# EAGLE design four_channel_audio_mixer (EAGLE 9.6.2)

## Sheet 1 of 3
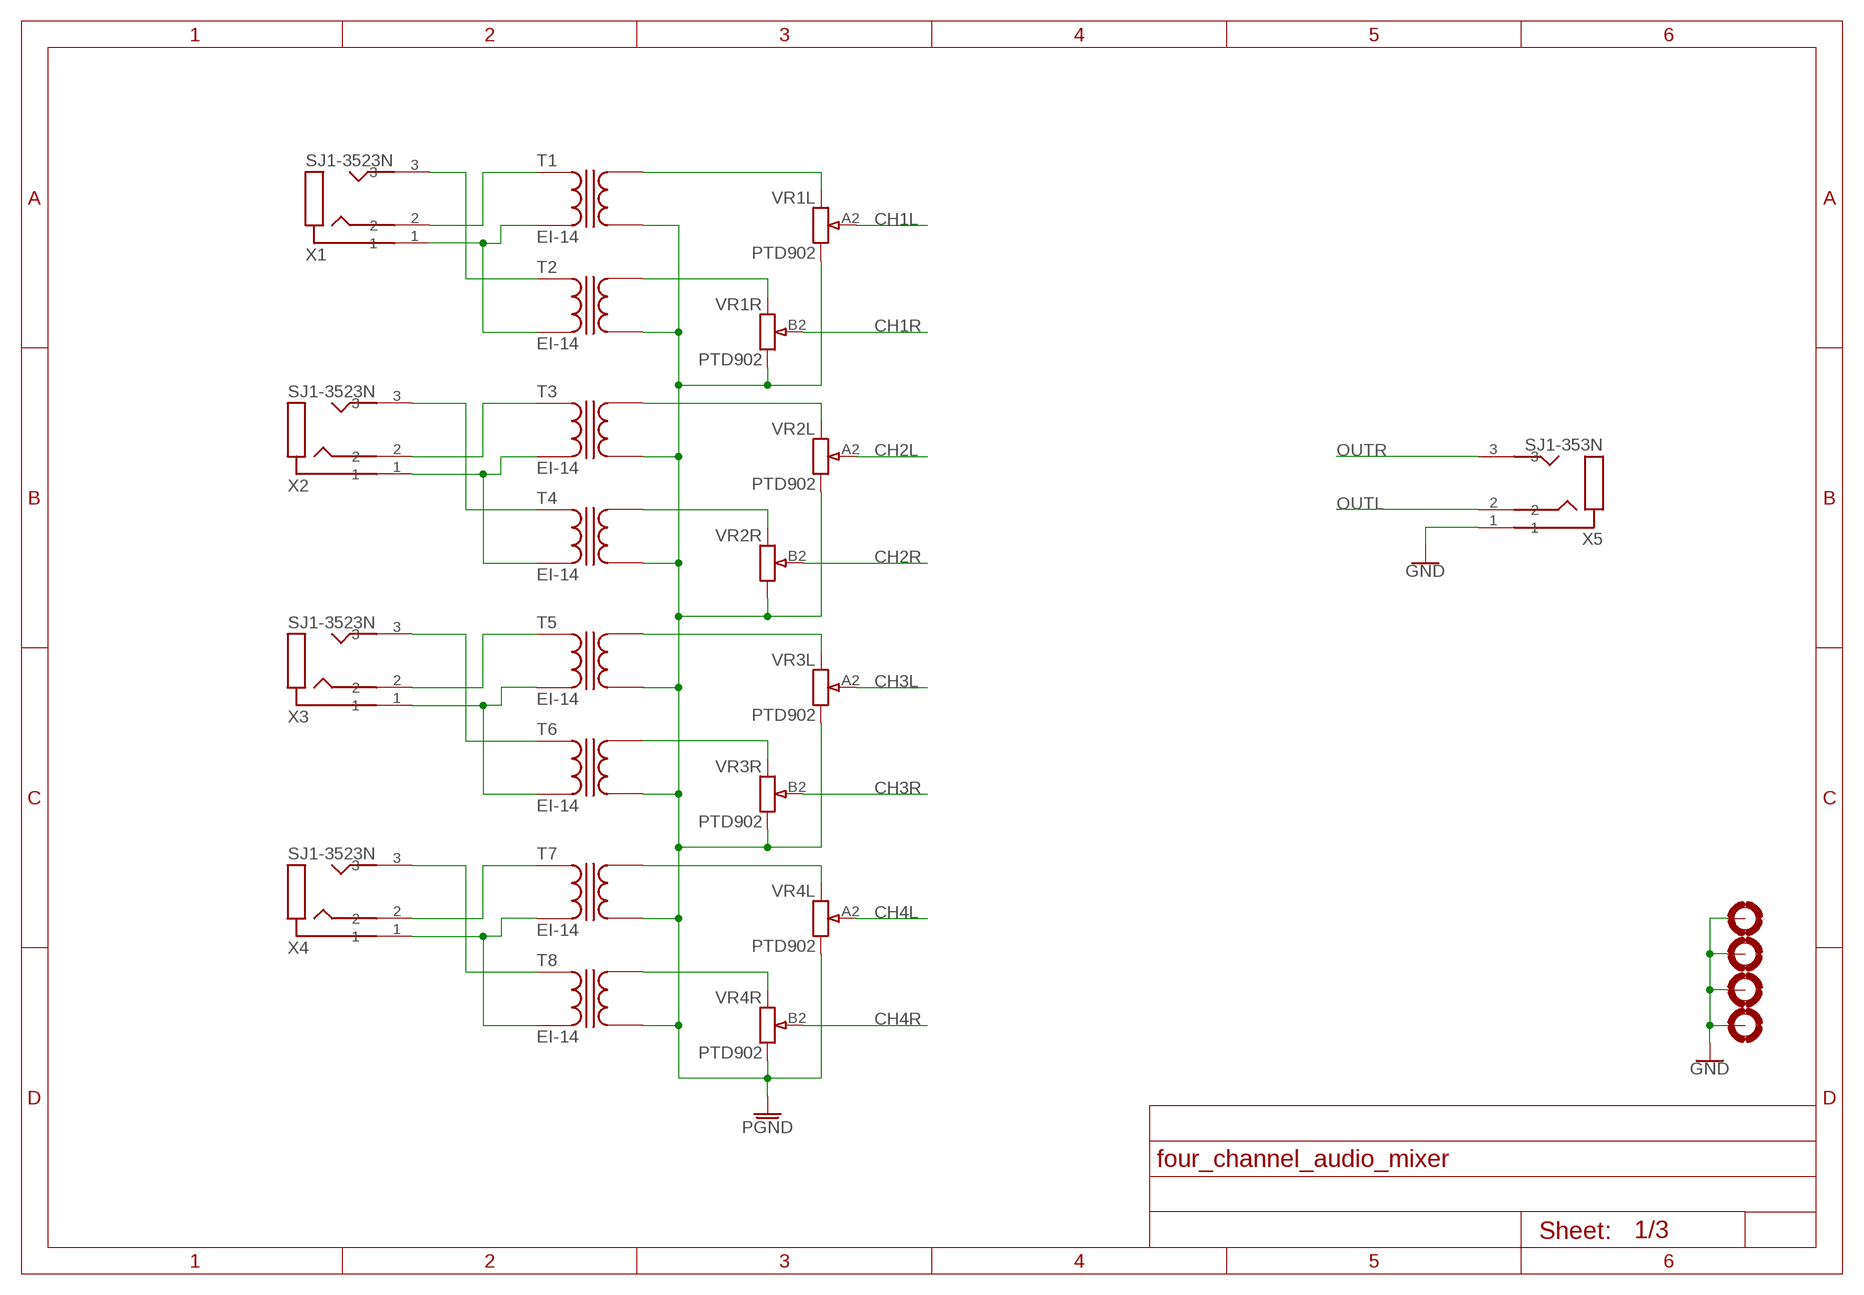
[diagram p0: schematic, sheet 1]

### Parts
H1  MOUNTHOLE-PAD3.2  [3.2-PAD]
H2  MOUNTHOLE-PAD3.2  [3.2-PAD]
H3  MOUNTHOLE-PAD3.2  [3.2-PAD]
H4  MOUNTHOLE-PAD3.2  [3.2-PAD]
T1  EI-14  TRANSFORMEREI14  [TRANSFORMER_EI14]
T2  EI-14  TRANSFORMEREI14  [TRANSFORMER_EI14]
T3  EI-14  TRANSFORMEREI14  [TRANSFORMER_EI14]
T4  EI-14  TRANSFORMEREI14  [TRANSFORMER_EI14]
T5  EI-14  TRANSFORMEREI14  [TRANSFORMER_EI14]
T6  EI-14  TRANSFORMEREI14  [TRANSFORMER_EI14]
T7  EI-14  TRANSFORMEREI14  [TRANSFORMER_EI14]
T8  EI-14  TRANSFORMEREI14  [TRANSFORMER_EI14]
VR1  PTD902  POT-PTD902  [POT-PTD902]
VR2  PTD902  POT-PTD902  [POT-PTD902]
VR3  PTD902  POT-PTD902  [POT-PTD902]
VR4  PTD902  POT-PTD902  [POT-PTD902]
X1  SJ1-3523N  AUDIO-3.5-SJ1-3523N  [AUDIO-3.5-SJ1-3523N]
X2  SJ1-3523N  AUDIO-3.5-SJ1-3523N  [AUDIO-3.5-SJ1-3523N]
X3  SJ1-3523N  AUDIO-3.5-SJ1-3523N  [AUDIO-3.5-SJ1-3523N]
X4  SJ1-3523N  AUDIO-3.5-SJ1-3523N  [AUDIO-3.5-SJ1-3523N]
X5  SJ1-353N  AUDIO-3.5-SJ1-3523N  [AUDIO-3.5-SJ1-3523N]

### Nets
CH1L: VR1.A2 ; also sheet 2
CH1R: VR1.B2 ; also sheet 2
CH2L: VR2.A2 ; also sheet 2
CH2R: VR2.B2 ; also sheet 2
CH3L: VR3.A2 ; also sheet 2
CH3R: VR3.B2 ; also sheet 2
CH4L: VR4.A2 ; also sheet 2
CH4R: VR4.B2 ; also sheet 2
GND: H1.B3,2(MOUNT) H2.B3,2(MOUNT) H3.B3,2(MOUNT) H4.B3,2(MOUNT) X5.1 ; also sheet 2,3
N$1: T1.A1 X1.2
N$2: T2.A1 X1.3
N$3: T3.A2 T4.A2 X2.1
N$4: T1.A2 T2.A2 X1.1
N$5: T1.B2 VR1.A3
N$7: T2.B2 VR1.B3
N$8: T3.A1 X2.2
N$9: T4.A1 X2.3
N$10: T5.A2 T6.A2 X3.1
N$11: T5.A1 X3.2
N$13: T6.A1 X3.3
N$14: T7.A2 T8.A2 X4.1
N$15: T7.A1 X4.2
N$16: T8.A1 X4.3
N$17: T3.B2 VR2.A3
N$18: T4.B2 VR2.B3
N$21: T5.B2 VR3.A3
N$22: T6.B2 VR3.B3
N$25: T7.B2 VR4.A3
N$26: T8.B2 VR4.B3
OUTL: X5.2 ; also sheet 2
OUTR: X5.3 ; also sheet 2
PGND: T1.B1 T2.B1 T3.B1 T4.B1 T5.B1 T6.B1 T7.B1 T8.B1 VR1.A1 VR1.B1 VR2.A1 VR2.B1 VR3.A1 VR3.B1 VR4.A1 VR4.B1 ; also sheet 2,3

## Sheet 2 of 3
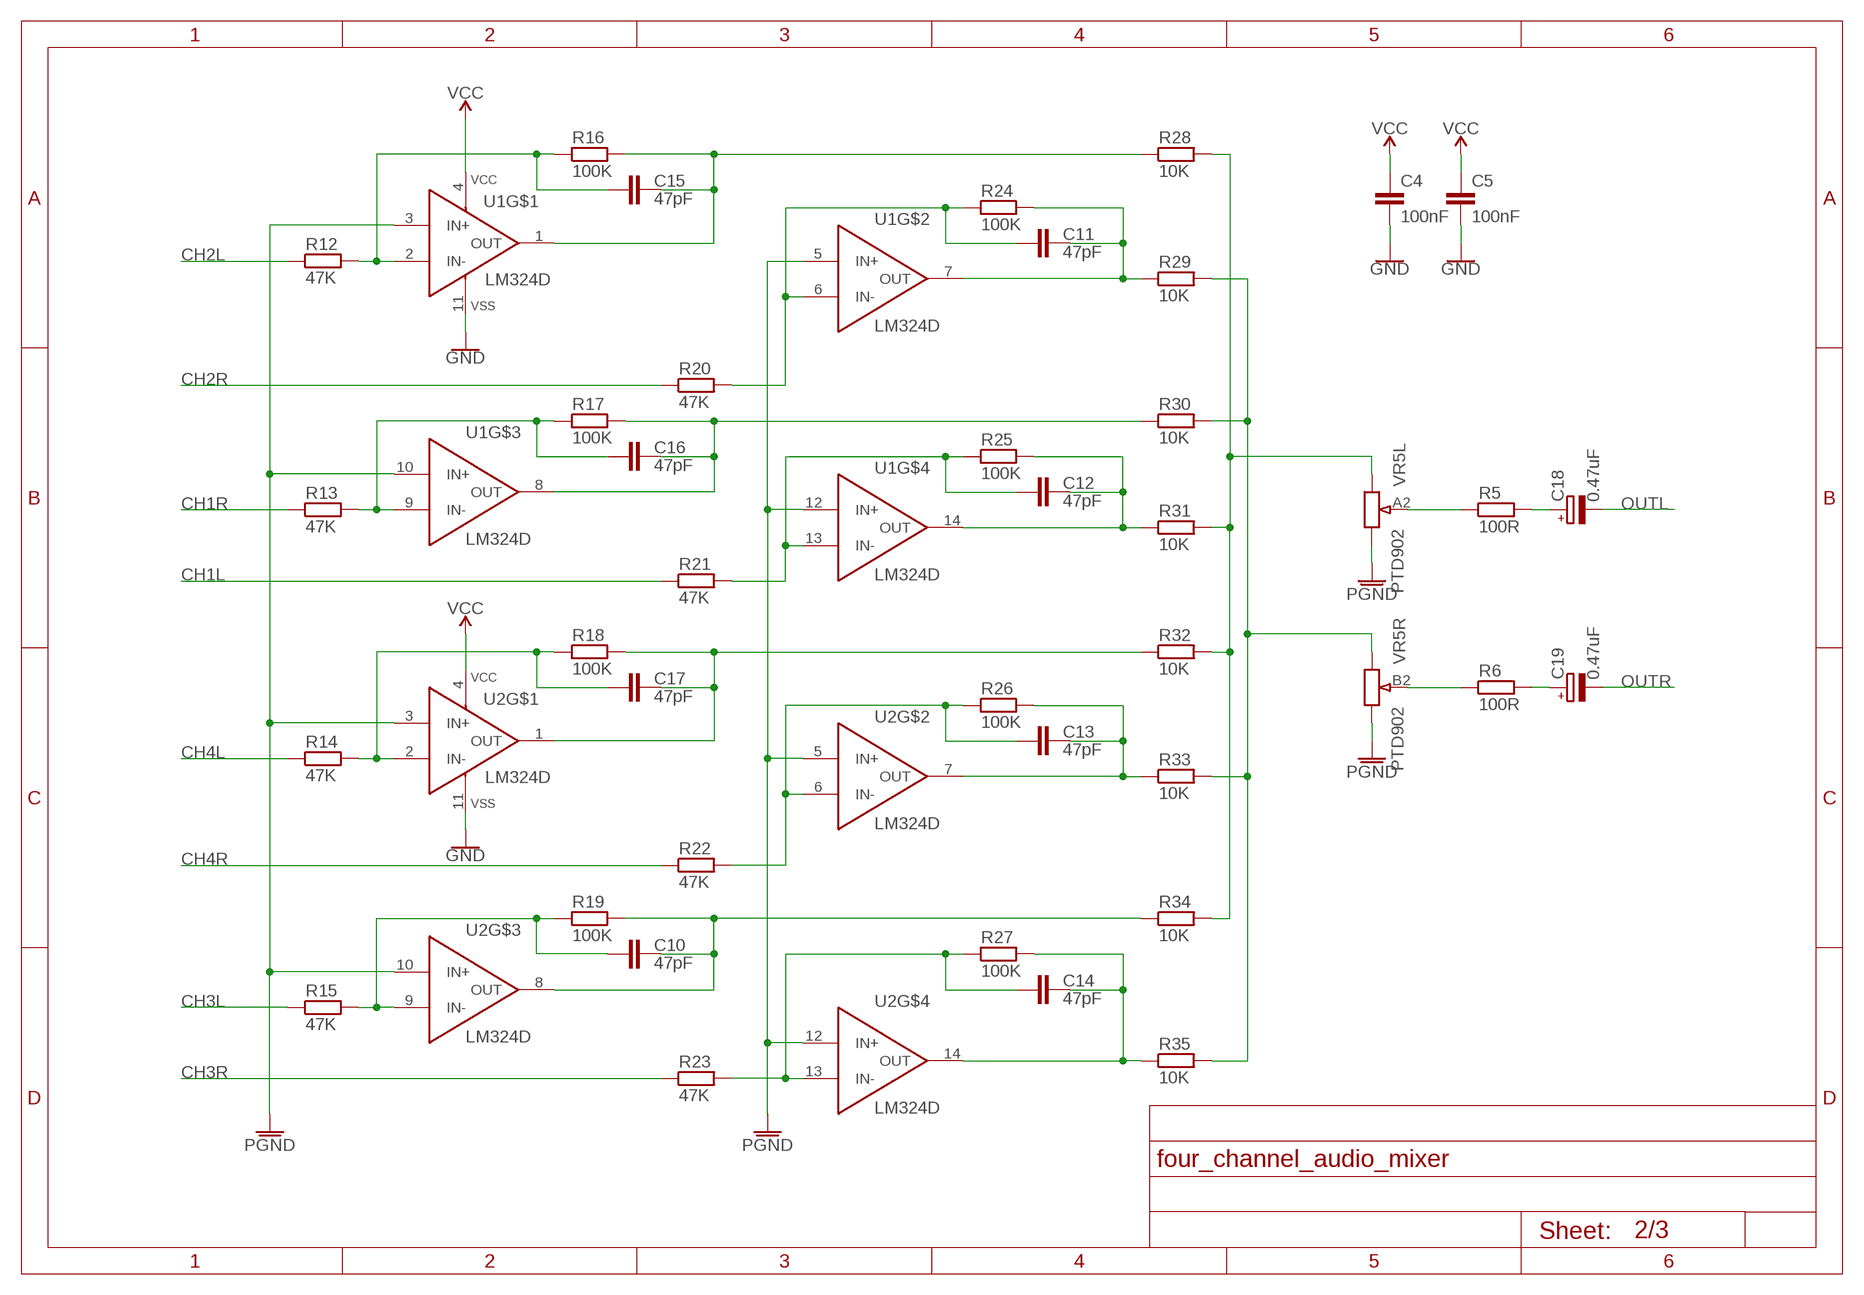
[diagram p1: schematic, sheet 2]

### Parts
C4  100nF  CAPC0603  [C0603]
C5  100nF  CAPC0603  [C0603]
C10  47pF  CAPC0603  [C0603]
C11  47pF  CAPC0603  [C0603]
C12  47pF  CAPC0603  [C0603]
C13  47pF  CAPC0603  [C0603]
C14  47pF  CAPC0603  [C0603]
C15  47pF  CAPC0603  [C0603]
C16  47pF  CAPC0603  [C0603]
C17  47pF  CAPC0603  [C0603]
C18  0.47uF  CAP-POL-ALUMWURTH-4.0X5.5  [WE-4.0X5.5]
C19  0.47uF  CAP-POL-ALUMWURTH-4.0X5.5  [WE-4.0X5.5]
R5  100R  RESISTOR0603  [R0603]
R6  100R  RESISTOR0603  [R0603]
R12  47K  RESISTOR0603  [R0603]
R13  47K  RESISTOR0603  [R0603]
R14  47K  RESISTOR0603  [R0603]
R15  47K  RESISTOR0603  [R0603]
R16  100K  RESISTOR0603  [R0603]
R17  100K  RESISTOR0603  [R0603]
R18  100K  RESISTOR0603  [R0603]
R19  100K  RESISTOR0603  [R0603]
R20  47K  RESISTOR0603  [R0603]
R21  47K  RESISTOR0603  [R0603]
R22  47K  RESISTOR0603  [R0603]
R23  47K  RESISTOR0603  [R0603]
R24  100K  RESISTOR0603  [R0603]
R25  100K  RESISTOR0603  [R0603]
R26  100K  RESISTOR0603  [R0603]
R27  100K  RESISTOR0603  [R0603]
R28  10K  RESISTOR0603  [R0603]
R29  10K  RESISTOR0603  [R0603]
R30  10K  RESISTOR0603  [R0603]
R31  10K  RESISTOR0603  [R0603]
R32  10K  RESISTOR0603  [R0603]
R33  10K  RESISTOR0603  [R0603]
R34  10K  RESISTOR0603  [R0603]
R35  10K  RESISTOR0603  [R0603]
U1  LM324D  OPAMP-LM324D  [SOIC-14]
U2  LM324D  OPAMP-LM324D  [SOIC-14]
VR5  PTD902  POT-PTD902  [POT-PTD902]

### Nets
CH1L: R21.1 ; also sheet 1
CH1R: R13.1 ; also sheet 1
CH2L: R12.1 ; also sheet 1
CH2R: R20.1 ; also sheet 1
CH3L: R15.1 ; also sheet 1
CH3R: R23.1 ; also sheet 1
CH4L: R14.1 ; also sheet 1
CH4R: R22.1 ; also sheet 1
F1L: C12.2 R21.2 R25.1 U1.13(IN-)
F1R: C16.2 R13.2 R17.1 U1.9(IN-)
F2L: C11.2 R20.2 R24.1 U1.6(IN-)
F2R: C15.2 R12.2 R16.1 U1.2(IN-)
GND: C4.2 C5.2 U1.11(VSS) U2.11(VSS) ; also sheet 1,3
MIXL: R28.2 R31.2 R32.2 R34.2 VR5.A3
MIXR: R29.2 R30.2 R33.2 R35.2 VR5.B3
N$6: C18.+ R5.2
N$20: R5.1 VR5.A2
N$23: C19.+ R6.2
N$32: R6.1 VR5.B2
N$56: C15.1 R16.2 R28.1 U1.1(OUT)
N$57: C11.1 R24.2 R29.1 U1.7(OUT)
N$59: C16.1 R17.2 R30.1 U1.8(OUT)
N$61: C12.1 R25.2 R31.1 U1.14(OUT)
N$62: C17.1 R18.2 R32.1 U2.1(OUT)
N$63: C17.2 R14.2 R18.1 U2.2(IN-)
N$65: C13.1 R26.2 R33.1 U2.7(OUT)
N$66: C10.1 R19.2 R34.1 U2.8(OUT)
N$67: C10.2 R15.2 R19.1 U2.9(IN-)
N$69: C14.1 R27.2 R35.1 U2.14(OUT)
N$85: C13.2 R22.2 R26.1 U2.6(IN-)
N$86: C14.2 R23.2 R27.1 U2.13(IN-)
OUTL: C18.- ; also sheet 1
OUTR: C19.- ; also sheet 1
PGND: U1.3(IN+) U1.5(IN+) U1.10(IN+) U1.12(IN+) U2.3(IN+) U2.5(IN+) U2.10(IN+) U2.12(IN+) VR5.A1 VR5.B1 ; also sheet 1,3
VCC: C4.1 C5.1 U1.4(VCC) U2.4(VCC) ; also sheet 3

## Sheet 3 of 3
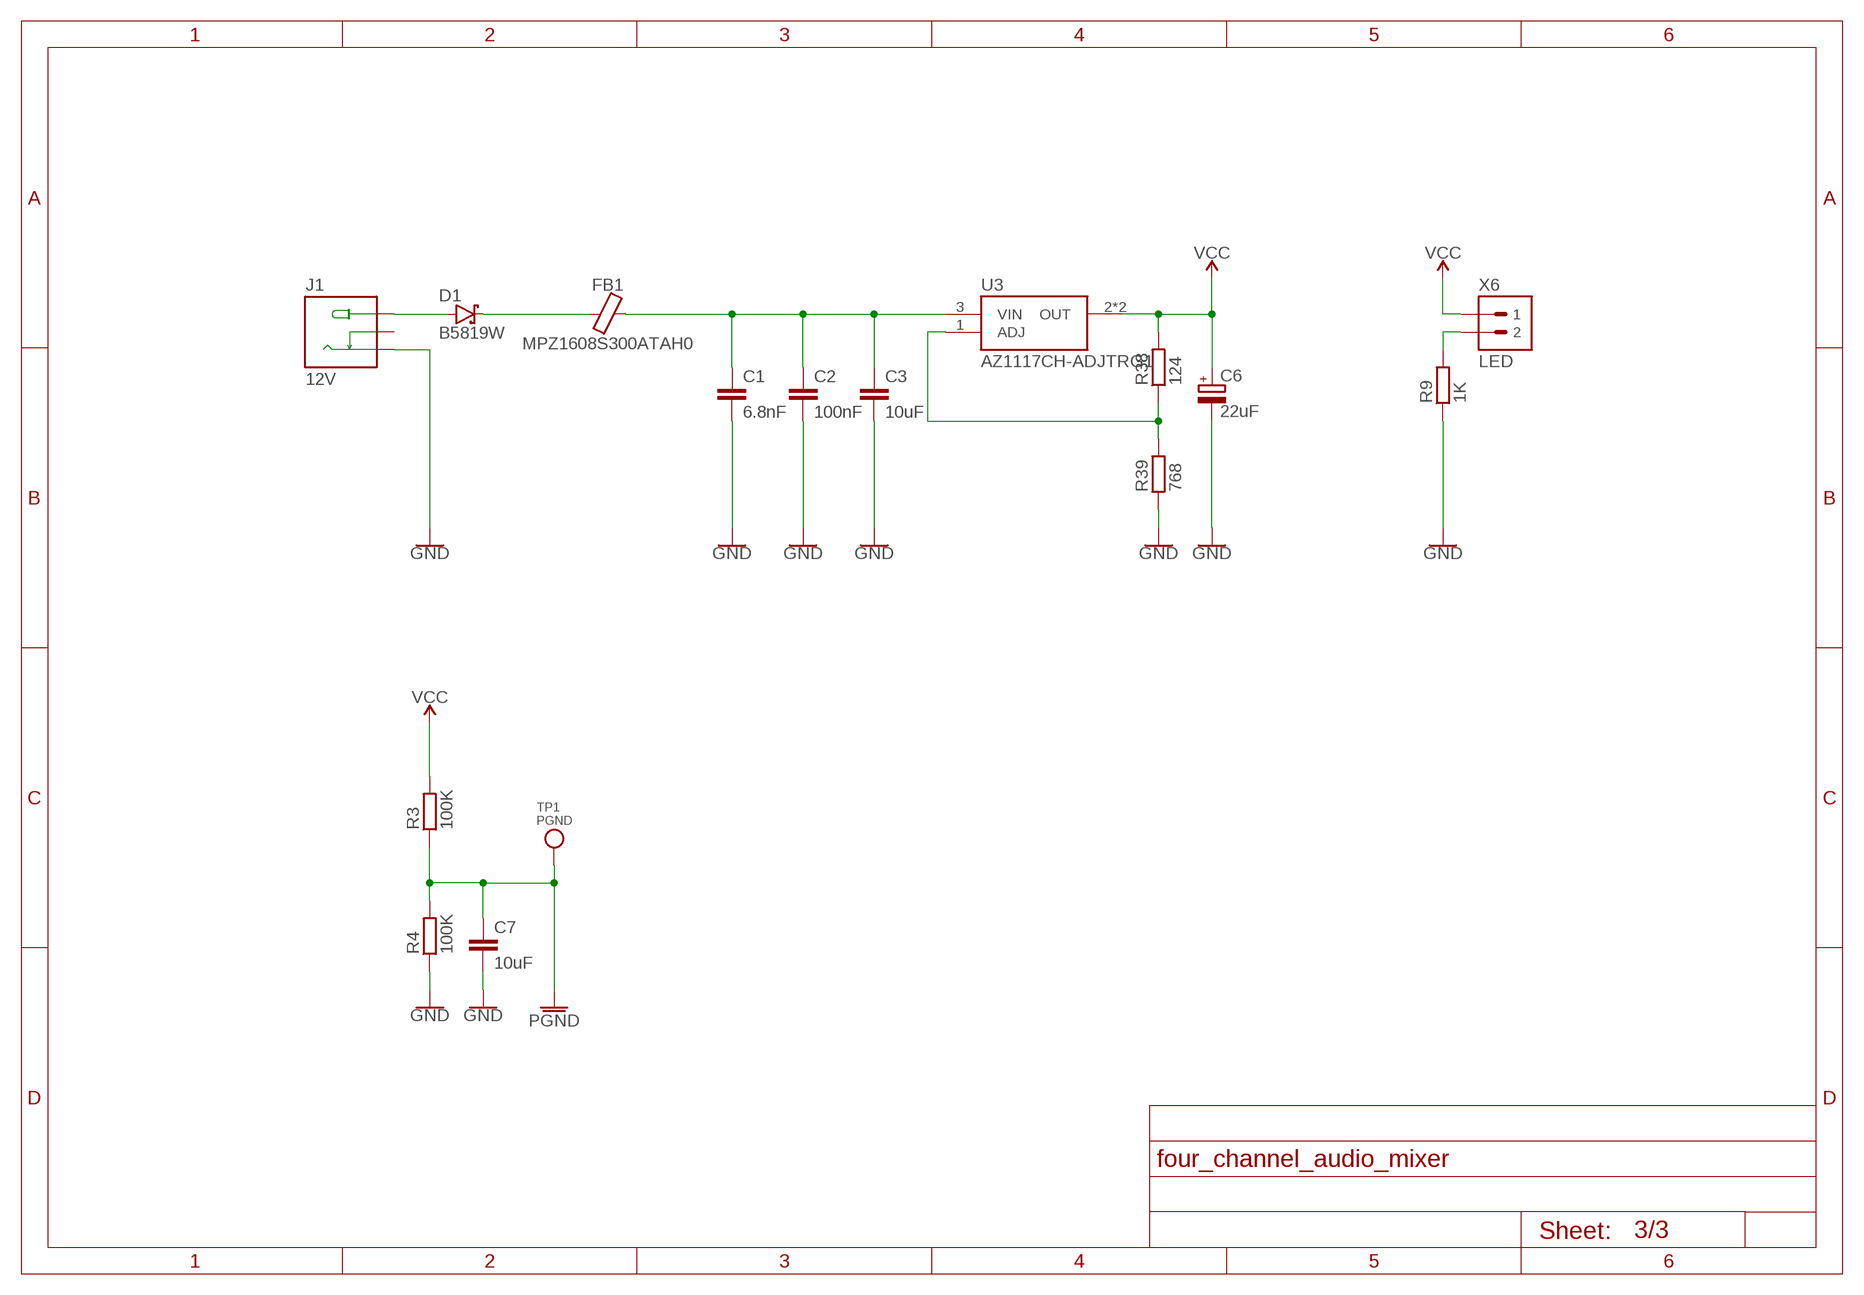
[diagram p2: schematic, sheet 3]

### Parts
C1  6.8nF  CAPC0603  [C0603]
C2  100nF  CAPC0603  [C0603]
C3  10uF  CAPC0603  [C0603]
C6  22uF  CAP-TANT-HUNANB-3528  [CASE-B-3528]
C7  10uF  CAPC0603  [C0603]
D1  B5819W  DIODE-SCHOTTKYSOD-123  [SOD-123]
FB1  MPZ1608S300ATAH0  BEADMPZ1608  [MPZ1608]
J1  12V  CONN-POWER-JACK-2.1MM(DC-005)5DJ20DC02  [5DJ20DC02-03T0BLB-01-14.5X10.7.0X9.0MM]
R3  100K  RESISTOR0603  [R0603]
R4  100K  RESISTOR0603  [R0603]
R9  1K  RESISTOR0603  [R0603]
R38  124  RESISTOR0603  [R0603]
R39  768  RESISTOR0603  [R0603]
TP1  PGND  TESTPOINT0.1"  [1X01_ROUND]
U3  AZ1117CH-ADJTRG1  DIODES-AZ1117CH-ADJTRG1  [SOT-223]
X6  LED  HEADER-1X02-2.54POL  [1X02P-2.54]

### Nets
GND: C1.2 C2.2 C3.2 C6.- C7.2 J1.-1(-) R4.1 R9.1 R39.1 ; also sheet 1,2
N$24: R9.2 X6.2
N$27: D1.A J1.+
N$28: R38.1 R39.2 U3.1(ADJ)
N$29: C1.1 C2.1 C3.1 FB1.2 U3.3(VIN)
N$30: D1.C FB1.1
PGND: C7.1 R3.1 R4.2 TP1.1 ; also sheet 1,2
VCC: C6.+ R3.2 R38.2 U3.2(OUT) U3.4(OUT) X6.1 ; also sheet 2
Unconnected: J1.-2(CDN)

## Library data of the parts
C1-C5 C7 C10-C17 = M2M-Passives:CAP
C6 = M2M-Passives:CAP-TANT-HUNAN
C18 C19 = M2M-Passives:CAP-POL-ALUM
D1 = M2M-DiscreteSemi:DIODE-SCHOTTKY: 304020028
FB1 = M2M-Passives:BEAD
H1-H4 = M2M-Holes:MOUNTHOLE-PAD
J1 = M2M-Connectors:CONN-POWER-JACK-2.1MM(DC-005): 320120003
R3-R6 R9 R12-R35 R38 R39 = M2M-Passives:RESISTOR
T1-T8 = M2M-Passives:TRANSFORMER
TP1 = M2M-TestPoints:TESTPOINT: Test Point Various test points for characterisation and PCB testing TESTPOINT_SMT - Compact Surface Mount Test Point [Digikey: 5016KTR-ND]; BOM: EXCLUDE
U1 U2 = M2M-IC:OPAMP-LM324D
U3 = M2M-IC:DIODES-AZ1117CH-ADJTRG1
VR1-VR5 = M2M-Passives:POT-PTD902
X1-X5 = M2M-Connectors:AUDIO-3.5-SJ1-3523N
X6 = M2M-Connectors:HEADER-1X02-2.54

## Board
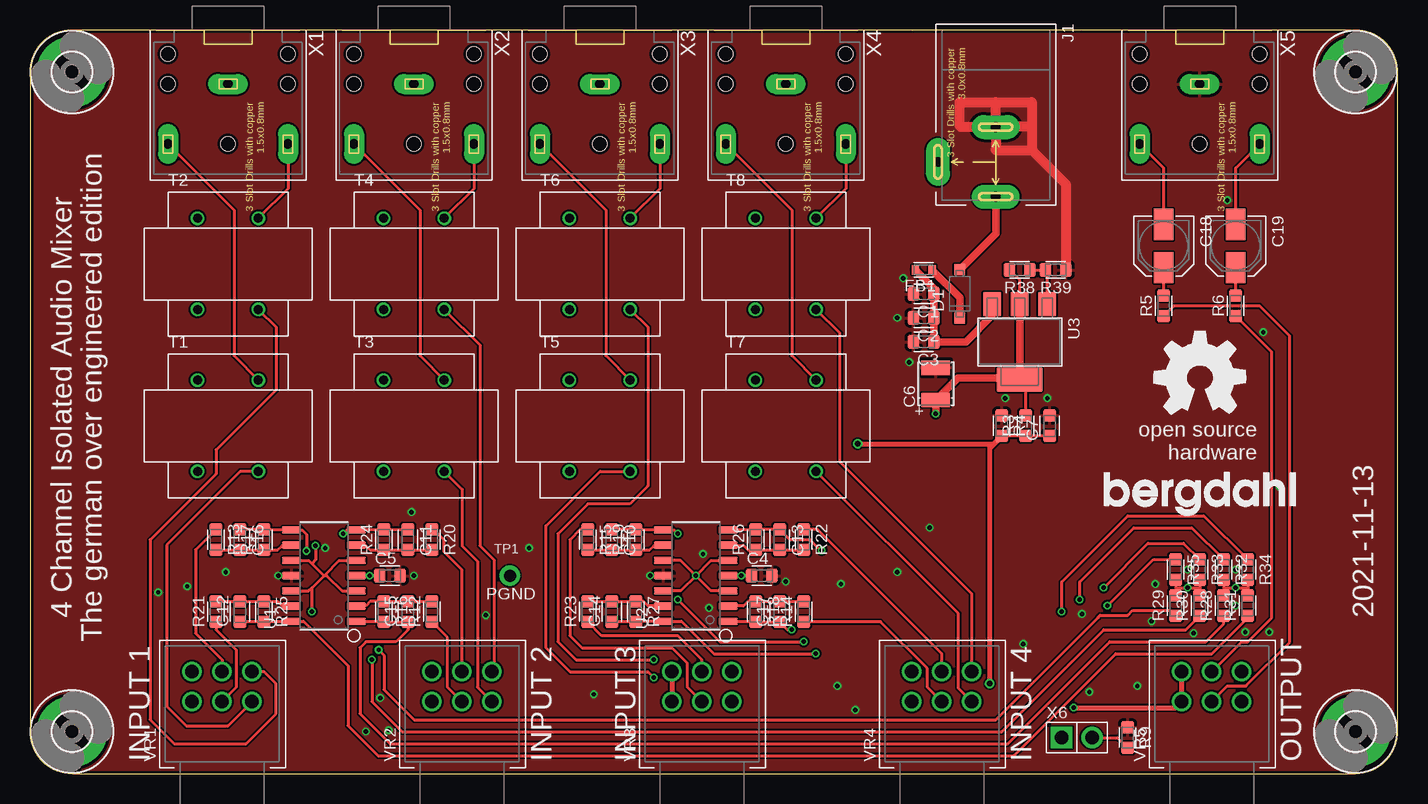
[diagram p3: board, top side]
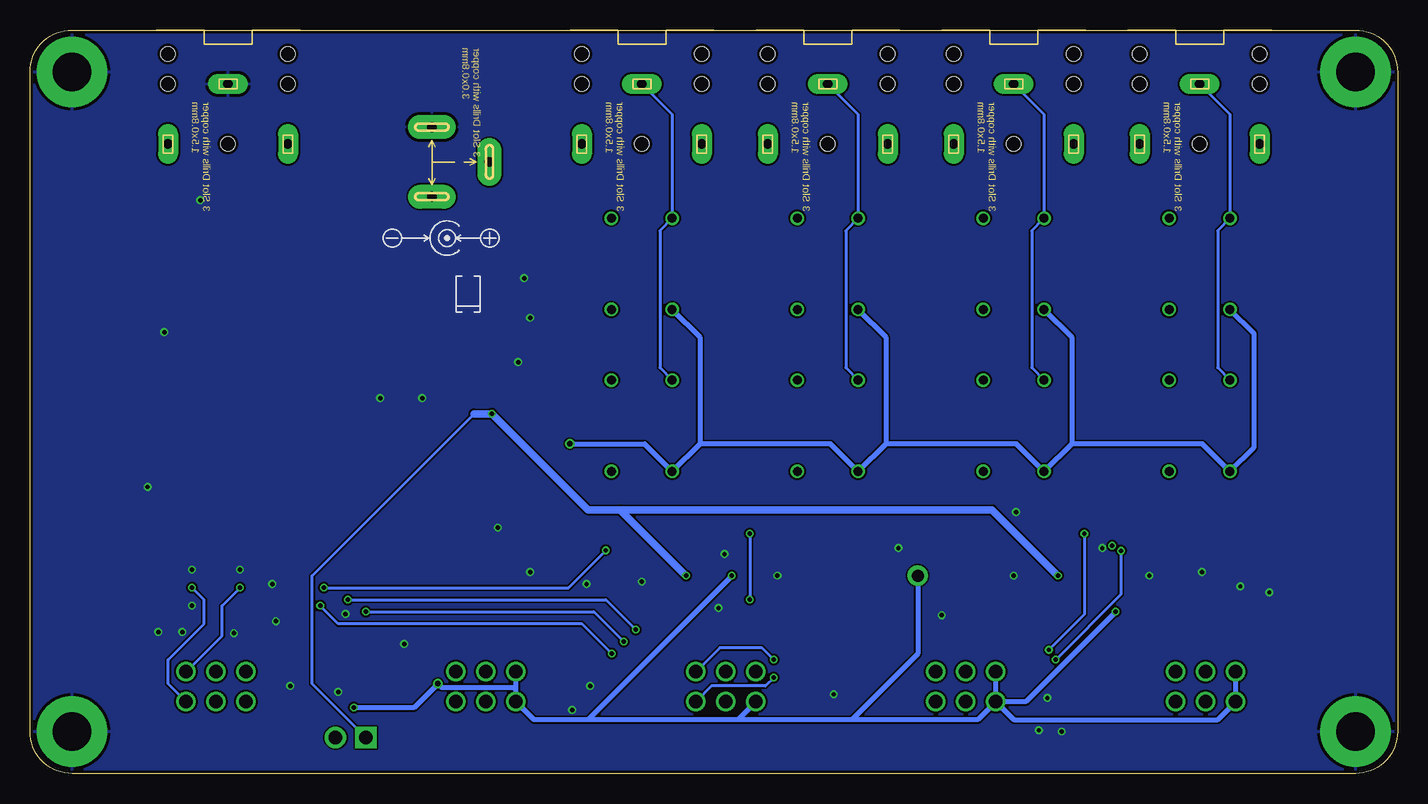
[diagram p4: board, bottom side, seen from below]

Size 114 x 62 mm. Coordinates in mm from the lower left corner, seen from the top.
Outline: 0,58.5 0,3.5 arc90 3.5,0 110.5,0 arc90 114,3.5 114,58.5 arc90 110.5,62 3.5,62 arc90 0,58.5
Copper layers (1*16): Top 0.035mm / dielectric 1.5mm / Bottom 0.035mm
Design rules "SeeedStudio_2layer_DRU_no_angle_20140221": minimum track width 6mil, minimum drill 0.3mm, track to track 6mil, track to pad 6mil, pad to pad 6mil, via to via 6mil, smd to smd 0mil, copper to edge 10mil, drill to drill 10mil, minimum pad ring 2mil, minimum via ring 6mil, stop-mask expansion 2mil, vias tented up to drill 1000mil, thermal gap 10mil

### Footprints (pad centres in the part's own frame; a part is rotated, then mirrored left to right if it is on the bottom)
C0603 = smd 1 x 1.1: 1 -0.85,0; 2 0.85,0
CASE-B-3528 = smd 1.2 x 2.4: + -1.35,0; - 1.35,0
WE-4.0X5.5 = smd 2.6 x 1.6: + 1.8,0; - -1.8,0
SOD-123 = smd 0.9 x 0.95: A 2.025,0; C -2.025,0
MPZ1608 = smd 0.6 x 0.8: 1 -0.7,0; 2 0.7,0
3.2-PAD = drill 3.2 pad 5.842: B3,2 0,0
5DJ20DC02-03T0BLB-01-14.5X10.7.0X9.0MM = drill 0.8 pad 2 long: + 2.9,0; -1 -2.9,0; -2 0,-4.8; -3 -2.9,0
R0603 = smd 1 x 1.1: 1 -0.85,0; 2 0.85,0
TRANSFORMER_EI14 = drill 0.75: A1 -3.81,2.54; A2 -3.81,-2.54; B1 3.81,-2.54; B2 3.81,2.54
1X01_ROUND = drill 1 pad 1.676: 1 0,0
SOIC-14 = smd 0.6 x 1.55: 1 -3.81,-2.7; 2 -2.54,-2.7; 3 -1.27,-2.7; 4 0,-2.7; 5 1.27,-2.7; 6 2.54,-2.7; 7 3.81,-2.7; 8 3.81,2.7; 9 2.54,2.7; 10 1.27,2.7; 11 0,2.7; 12 -1.27,2.7; 13 -2.54,2.7; 14 -3.81,2.7
SOT-223 = smd 1.5 x 2: 1 -2.3,-3.15; 2 0,-3.15; 3 2.3,-3.15 | smd 3.8 x 2: 4 0,3.15
POT-PTD902 = drill 1.1: A1 0,2.5; A2 0,0; A3 0,-2.5; B1 2.5,2.5; B2 2.5,0; B3 2.5,-2.5
AUDIO-3.5-SJ1-3523N = drill 0.8 pad 1.676 long: 1 0,0; 2 5,-5; 3 5,5 | hole 1.2: 5,0; 0,5; -2.5,5; -2.5,-5; 0,-5
1X02P-2.54 = drill 1.1 pad 1.778 square: 1 0,0 | drill 1.1 pad 1.778: 2 2.54,0

### Placement (x,y rotation side)
C1  74.5,40 180 top
C2  74.5,38 180 top
C3  74.5,36 180 top
C4  61,16.5 0 top
C5  30,16.5 0 top
C6  75.5,32.5 90 top
C7  85,29 90 top
C10  48.5,19.5 270 top
C11  31.5,19.5 270 top
C12  17.5,13.5 90 top
C13  62.5,19.5 270 top
C14  48.5,13.5 90 top
C15  31.5,13.5 90 top
C16  17.5,19.5 270 top
C17  62.5,13.5 90 top
C18  94.5,44 270 top
C19  100.5,44 270 top
D1  77.5,40 90 top
FB1  74.5,42 180 top
H1  110.5,3.5 0 top
H2  110.5,58.5 0 top
H3  3.5,3.5 0 top
H4  3.5,58.5 0 top
J1  80.5,51 270 top
R3  83,29 90 top
R4  81,29 270 top
R5  94.5,39 90 top
R6  100.5,39 90 top
R9  91.5,3 270 top
R12  33.5,13.5 90 top
R13  15.5,19.5 270 top
R14  64.5,13.5 90 top
R15  46.5,19.5 270 top
R16  29.5,13.5 270 top
R17  19.5,19.5 90 top
R18  60.5,13.5 270 top
R19  50.5,19.5 90 top
R20  33.5,19.5 270 top
R21  15.5,13.5 90 top
R22  64.5,19.5 270 top
R23  46.5,13.5 90 top
R24  29.5,19.5 90 top
R25  19.5,13.5 270 top
R26  60.5,19.5 90 top
R27  50.5,13.5 270 top
R28  99.5,14 90 top
R29  95.5,14 90 top
R30  97.5,14 90 top
R31  101.5,14 90 top
R32  99.5,17 270 top
R33  97.5,17 270 top
R34  101.5,17 270 top
R35  95.5,17 270 top
R38  82.5,42 180 top
R39  85.5,42 180 top
T1  16.5,29 270 top
T2  16.5,42.5 270 top
T3  32,29 270 top
T4  32,42.5 270 top
T5  47.5,29 270 top
T6  47.5,42.5 270 top
T7  63,29 270 top
T8  63,42.5 270 top
TP1  40,16.5 0 top
U1  24.5,16.5 90 top
U2  55.5,16.5 90 top
U3  82.5,36 180 top
U$1  [BERGDAHL-20MM-TPLACE]  89.5,21.5 0 top
U$2  [OSHW-8MM-TPLACE]  97.5,33 0 top
VR1  16,6 90 top
VR2  36,6 90 top
VR3  56,6 90 top
VR4  76,6 90 top
VR5  98.5,6 90 top
X1  16.5,57.5 270 top
X2  32,57.5 270 top
X3  47.5,57.5 270 top
X4  63,57.5 270 top
X5  97.5,57.5 270 top
X6  86,3 0 top

### Tracks (layer width: path | path; a pad name or v marks a point on that pad's centre or on a via)
CH1L
  Top 0.254: VR1.A2 17.2,7.2 17.2,10.3 15.5,12 R21.1
CH1R
  Top 0.254: R13.1 13.8,18.65 13.8,11.7 16,9.5 VR1.B2
CH2L
  Top 0.254: VR2.A2 34.8,7.2 34.8,11 34.8,11.2 34.8,11.35 R12.1
CH2R
  Top 0.254: R20.1 33.65,20.35 34.5,19.5 34.5,18.5 36,17 VR2.B2
CH3L
  Top 0.254: VR3.A2 54.8,7.2 54.8,9.2 53.5,10.5 46,10.5 45,11.5 45,19.5 45.85,20.35 R15.1
CH3R
  Top 0.254: VR3.B2 56,9.5 54,11.5 47.65,11.5 R23.1
CH4L
  Top 0.254: VR4.A2 74.8,7.2 74.8,8.76 70.91,12.65 R14.1
CH4R
  Top 0.254: VR4.B2 76,10 65.65,20.35 R22.1
F1L
  Top 0.254: R21.2 C12.2 R25.1 20.65,14.35 21.04,13.96 U1.13
F1R
  Top 0.254: R13.2 C16.2 R17.1 20.65,18.65 21,19 21.76,19 U1.9
F2L
  Top 0.254: U1.6 27.96,19.04 28.35,18.65 R24.1 C11.2 R20.2
F2R
  Top 0.254: U1.2 27.24,14 28,14 28.35,14.35 R16.1 C15.2 R12.2
GND  (via drill 0.35)
  Top 0.254: U1.11 v20.7,16.5 | U2.11 v51.7,16.5
  Top 0.813: 83.5,52 80.5,52 J1.-1 | 83.5,54 83.5,56 80.5,56 | 83.5,54 83.5,52 | J1.-1 77.6,53.9 77.5,54 77.5,56 80.5,56 | J1.-1 80.5,56 | 83.5,52 86.35,49.15 R39.1 | J1.-1 80.6,54 83.5,54
  other vias: 75,20.5 63,16 32,16.5 29.2,6.3 47,6.6 72.3,16.8 67.6,15.8 56.6,13.8 56.1,18.3 41.6,18.8 24.6,18.8 16.3,16.8 10.7,15.1 13.1,15.6 38,13.2 67.3,7.3 82.8,10.8 99.8,47.8 31.8,21.8 101.3,11.8 104.2,23.9 93.8,15.8 68.8,5.3 29.9,3.6 28,3.5 84.8,31.3 81.3,31.3 73.3,34.3 72.8,41.3 72.3,38 92.3,7.3 88.3,6.8 97,11.7 100.5,14 103.3,11.8 102.8,36.8 87.7,13.3 96.5,17 100.5,17 93.5,12.7
  pour Bottom: 0,0 0,62.5 114,62.5 114,0
  pour Top: 0,62.5 114,62.5 114,-0.5 0,-0.5
MIXL  (via drill 0.35)
  Top 0.254: R32.2 99.5,15.5 | 99.5,15.5 R28.2 | R34.2 101.5,15.5 | 101.5,15.5 R31.2 | 99.5,15.5 v100.5,15.5 101.5,15.5
  Bottom 0.254: VR5.A3 102.5,7.5 102.5,9.5 99.5,12.5 99.5,14.5 v100.5,15.5
MIXR  (via drill 0.35)
  Top 0.254: R35.2 95.5,15.5 | 95.5,15.5 R29.2 | R33.2 97.5,15.5 | 97.5,15.5 R30.2 | 95.5,15.5 v96.5,15.5 97.5,15.5
  Bottom 0.254: VR5.B3 98,11.5 98,14 v96.5,15.5
N$1
  Top 0.254: X1.2 17,47 17,34.85 T1.A1
N$2
  Top 0.254: X1.3 21.5,48.77 T2.A1
N$3
  Bottom 0.254: X2.1 29.46,54.96 T4.A2 29.64,46.13 30.5,45.27 30.5,33.85 T3.A2
N$4
  Bottom 0.254: X1.1 13.96,54.96 T2.A2 15,45.27 15,33.85 T1.A2
N$5
  Top 0.254: T1.B2 17.54,25.19 11.4,19.05 11.4,5.6 13,4 16.5,4 VR1.A3
N$6
  Top 0.254: R5.2 C18.+
N$7
  Top 0.254: T2.B2 20.5,37.23 20.5,32 15.5,27 15.5,25 10,19.5 10,4.5 12,2.5 18,2.5 20.5,5 20.5,7.5 19.5,8.5 VR1.B3
N$8
  Top 0.254: X2.2 32.5,47 32.5,34.85 T3.A1
N$9
  Top 0.254: X2.3 37,48.77 T4.A1
N$10
  Bottom 0.254: X3.1 44.96,54.96 T6.A2 46,45.27 46,33.85 T5.A2
N$11
  Top 0.254: X3.2 48,47 48,34.85 T5.A1
N$13
  Top 0.254: X3.3 52.5,48.77 T6.A1
N$14
  Bottom 0.254: X4.1 60.46,54.96 T8.A2 61.5,45.27 61.5,33.85 T7.A2
N$15
  Top 0.254: X4.2 63.5,47 63.5,34.85 T7.A1
N$16
  Top 0.254: X4.3 68,48.77 T8.A1
N$17
  Top 0.254: T3.B2 36.04,23.69 36.04,18.96 37.3,17.7 37.3,7.2 VR2.A3
N$18
  Top 0.254: T4.B2 37.5,35.73 37.5,19 38.7,17.8 38.7,8.7 VR2.B3
N$20
  Top 0.254: R5.1 95.35,39 102.5,39 105,36.5 105,10.94 101.36,7.3 99.8,7.3 VR5.A2
N$21  (via drill 0.35)
  Top 0.254: T5.B2 47.54,25.19 43,20.65 43,10.5 45,8.5 51.5,8.5 v52,8
  Bottom 0.254: v52,8 52.7,7.3 57.2,7.3 VR3.A3
N$22  (via drill 0.35)
  Top 0.254: T6.B2 51.5,37.23 51.5,24 50,22.5 46.5,22.5 44,20 44,11 45.5,9.5 v52,9.5
  Bottom 0.254: v52,9.5 53,10.5 56.5,10.5 VR3.B3
N$23
  Top 0.254: R6.2 C19.+
N$24
  Top 0.254: X6.2 90.65,3 R9.2
N$25
  Top 0.254: VR4.A3 77.4,7.1 77.4,13.33 T7.B2
N$26
  Top 0.254: VR4.B3 78.5,15 67.5,26 67.5,36.73 T8.B2
N$27
  Top 0.61: J1.+ 80.5,45.02 D1.A
N$28
  Top 0.254: R38.1 R39.2 84.8,41.85 U3.1
N$29
  Top 0.61: U3.3 80.2,38.2 78,36 C3.1 C2.1 C1.1 75.35,40.45 FB1.2
N$30
  Top 0.61: FB1.1 77.5,39.7 D1.C
N$32
  Top 0.254: VR5.B2 101,11 101.5,11 103.5,13 103.5,35.15 R6.1
N$56
  Top 0.254: U1.1 29.46,12.69 R16.2 C15.1 31.5,12 30.5,11 28,11 27.5,10.5 27.5,5 30,2.5 81.5,2.5 90,11 98,11 99.5,12.5 R28.1
N$57  (via drill 0.35)
  Top 0.254: v26.11,20 26.42,20.31 U1.7 27.24,20.35 R24.2 C11.1 | v29.05,10.31 29.5,9.86 29.5,7 32,4.5 80.5,4.5 89,13 89.15,13.15 89.2,13.2 91.5,13.2 91.9,13.6 95.05,13.6 R29.1
  Bottom 0.254: v26.11,20 26.11,13.25 v29.05,10.31
N$59  (via drill 0.35)
  Top 0.254: v23.04,18.57 23.04,19.96 22.69,20.31 U1.8 19.54,20.31 R17.2 C16.1 | v28.5,9.5 28.5,6 31,3.5 81,3.5 89.5,12 96.35,12 R30.1
  Bottom 0.254: v23.04,18.57 23.04,14.96 v28.5,9.5
N$61
  Top 0.254: C12.1 R25.2 21.76,12.65 U1.14 22.81,12.69 26.5,9 26.5,4 29,1.5 82,1.5 90.5,10 98.5,10 101.5,13 R31.1
N$62  (via drill 0.35)
  Top 0.254: U2.1 60.46,12.69 R18.2 C17.1 63.15,12 v63.5,12 | v87.5,14.5 87.5,16 92,20.5 96.85,20.5 R32.1
  Bottom 0.254: v63.5,12 66,14.5 v87.5,14.5
N$63
  Top 0.254: U2.2 59.46,13.96 59.85,14.35 R18.1 C17.2 R14.2
N$65  (via drill 0.35)
  Top 0.254: U2.7 58.24,20.35 R26.2 C13.1 63.35,19.5 65.02,19.5 65.92,18.61 v66,18.61 | v89.5,15.5 93.2,19.2 96.15,19.2 R33.1
  Bottom 0.254: v66,18.61 69.11,15.5 v89.5,15.5
N$66  (via drill 0.35)
  Top 0.254: v54,20 53.69,20.31 U2.8 50.54,20.31 R19.2 C10.1 | v54,14.5 57.5,11 v64.5,11 | v86,13.5 86,16 91.5,21.5 97.85,21.5 R34.1
  Bottom 0.254: v54,20 v54,14.5 | v86,13.5 67,13.5 v64.5,11
N$67
  Top 0.254: R15.2 C10.2 R19.1 51.65,18.65 52,19 52.76,19 U2.9
N$69  (via drill 0.35)
  Top 0.254: C14.1 R27.2 50.54,12.69 U2.14 54.31,12.69 57,10 v65.5,10 | R35.1 94,17.85 93.65,17.85 v89.8,14
  Bottom 0.254: v65.5,10 68,12.5 88.3,12.5 v89.8,14
N$85
  Top 0.254: U2.6 59.46,19.04 59.85,18.65 R26.1 C13.2 R22.2
N$86
  Top 0.254: R23.2 C14.2 R27.1 51.15,14.35 51.54,13.96 U2.13
OUTL
  Top 0.254: C18.- 94.5,50.5 X5.2
OUTR
  Top 0.254: C19.- 100.5,50.5 X5.3
PGND  (via drill 0.35, 0.45)
  Top 0.254: 23.5,15.5 23.23,15.23 U1.12 | 23.5,15.5 24.5,16.5 | 24.5,16.5 25.77,17.77 U1.5 | 24.5,16.5 24.73,16.5 26,15.23 U1.3 | 24.5,16.5 23.5,17.5 | 23.5,17.5 23.23,17.77 U1.10 | v23.79,19 23.79,17.79 23.5,17.5 | U2.10 54.23,17.77 v55.5,16.5 | U2.3 56.77,15.23 v55.5,16.5 | U2.12 54.23,15.23 v55.5,16.5 | U2.5 56.77,17.77 v55.5,16.5 | v23.5,13.5 23.5,15.5 | C7.1 R3.1 R4.2
  Top 0.406: VR3.B1 VR3.A1 | v69,27.5 80.35,27.5 | 80.35,27.5 R4.2 | 80.35,27.5 80,27.15 v80,7.5 | v87,5.5 95.5,5.5 VR5.A1 VR5.B1
  Bottom 0.406: 73.5,7 VR4.A1 72,4.5 67.5,4.5 | 73.5,7 VR4.B1 | VR2.A1 35,4.5 45.5,4.5 | 45.5,4.5 55,4.5 | VR2.A1 32,4.5 15,4.5 VR1.A1 VR1.B1 | VR2.A1 VR2.B1 | T2.B1 12,36.73 12,27.15 T1.B1 16.27,27.5 27.15,27.5 | 27.15,27.5 T3.B1 31.77,27.5 42.65,27.5 | 42.65,27.5 T5.B1 47.27,27.5 58.15,27.5 | T4.B1 27.15,36.38 27.15,27.5 | T6.B1 42.65,36.38 42.65,27.5 | 58.15,27.5 T7.B1 62.77,27.5 v69,27.5 | T8.B1 58.15,36.38 58.15,27.5 | 73.5,7 73.68,7.18 79.68,7.18 v80,7.5 82,5.5 v87,5.5 | VR3.A1 55,4.5 | 55,4.5 67.5,4.5 | v55.5,16.5 67.5,4.5 | v23.5,13.5 31,6 VR2.A1 | TP1.1 40,10 45.5,4.5
VCC  (via drill 0.35)
  Top 0.152: U3.4 82.67,32.67
  Top 0.254: U1.4 v28.3,16.5 C5.1 | C4.1 v59.3,16.5 U2.4 | U3.2 82.5,41.15 R38.2 | R3.2 83,32.35 82.67,32.67
  Top 0.61: U3.2 U3.4 82.35,33 77.35,33 C6.+ v75.5,30
  Bottom 0.254: X6.1 90.5,7.5 90.5,16.5 77,30
  Bottom 0.61: v28.3,16.5 33.8,22 64.8,22 | 64.8,22 67.5,22 v75.5,30 77,30 | v59.3,16.5 64.8,22

### Text on the board
tPlace: PGND | 4 Channel Isolated Audio Mixer | 2021-11-13 | The german over engineered edition | INPUT 1 | INPUT 2 | INPUT 3 | INPUT 4 | OUTPUT